# Altium schematic sheet split4.SchDoc
size A; SheetNumber: 4; SheetTotal: 9
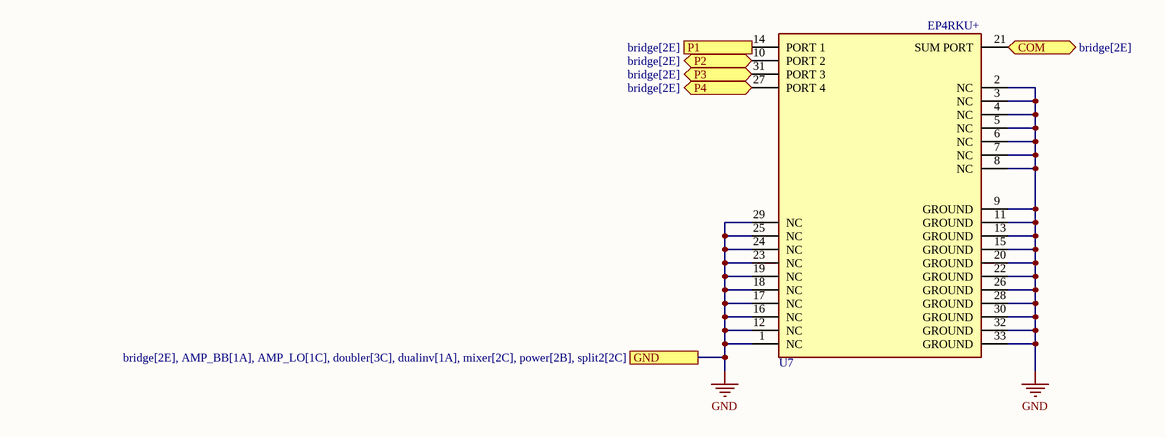
[diagram p0: split4.SchDoc]

## Parts
U7  EP4RKU+  [EP4RKU+]

## Ports
COM (bidir, see bridge[2E]), GND (see bridge[2E], AMP_BB[1A], AMP_LO[1C], doubler[3C], dualinv[1A], mixer[2C], power[2B], split2[2C]), P1 (in, see bridge[2E]), P2 (bidir, see bridge[2E]), P3 (bidir, see bridge[2E]), P4 (bidir, see bridge[2E])

## Nets
GND: U7.1(NC) U7.2(NC) U7.3(NC) U7.4(NC) U7.5(NC) U7.6(NC) U7.7(NC) U7.8(NC) U7.9(GROUND) U7.11(GROUND) U7.12(NC) U7.13(GROUND) U7.15(GROUND) U7.16(NC) U7.17(NC) U7.18(NC) U7.19(NC) U7.20(GROUND) U7.22(GROUND) U7.23(NC) U7.24(NC) U7.25(NC) U7.26(GROUND) U7.28(GROUND) U7.29(NC) U7.30(GROUND) U7.32(GROUND) U7.33(GROUND) ; port GND
COM: U7.21(SUM_PORT) ; port COM
P1: U7.14(PORT_1) ; port P1
P2: U7.10(PORT_2) ; port P2
P3: U7.31(PORT_3) ; port P3
P4: U7.27(PORT_4) ; port P4

## Library data of the parts
U7 = EP4RKU+: Power Splitter/Combiner 4 Way-0° 50Ω DC to 18 GHz; Manufacturer: Mini-Circuits; Part Number: EP4RKU+; Supplier 1: Digikey; Supplier Part Number 1: 3157-EP4RKU+CT-ND